# EAGLE schematic main (EAGLE 9.5.2)
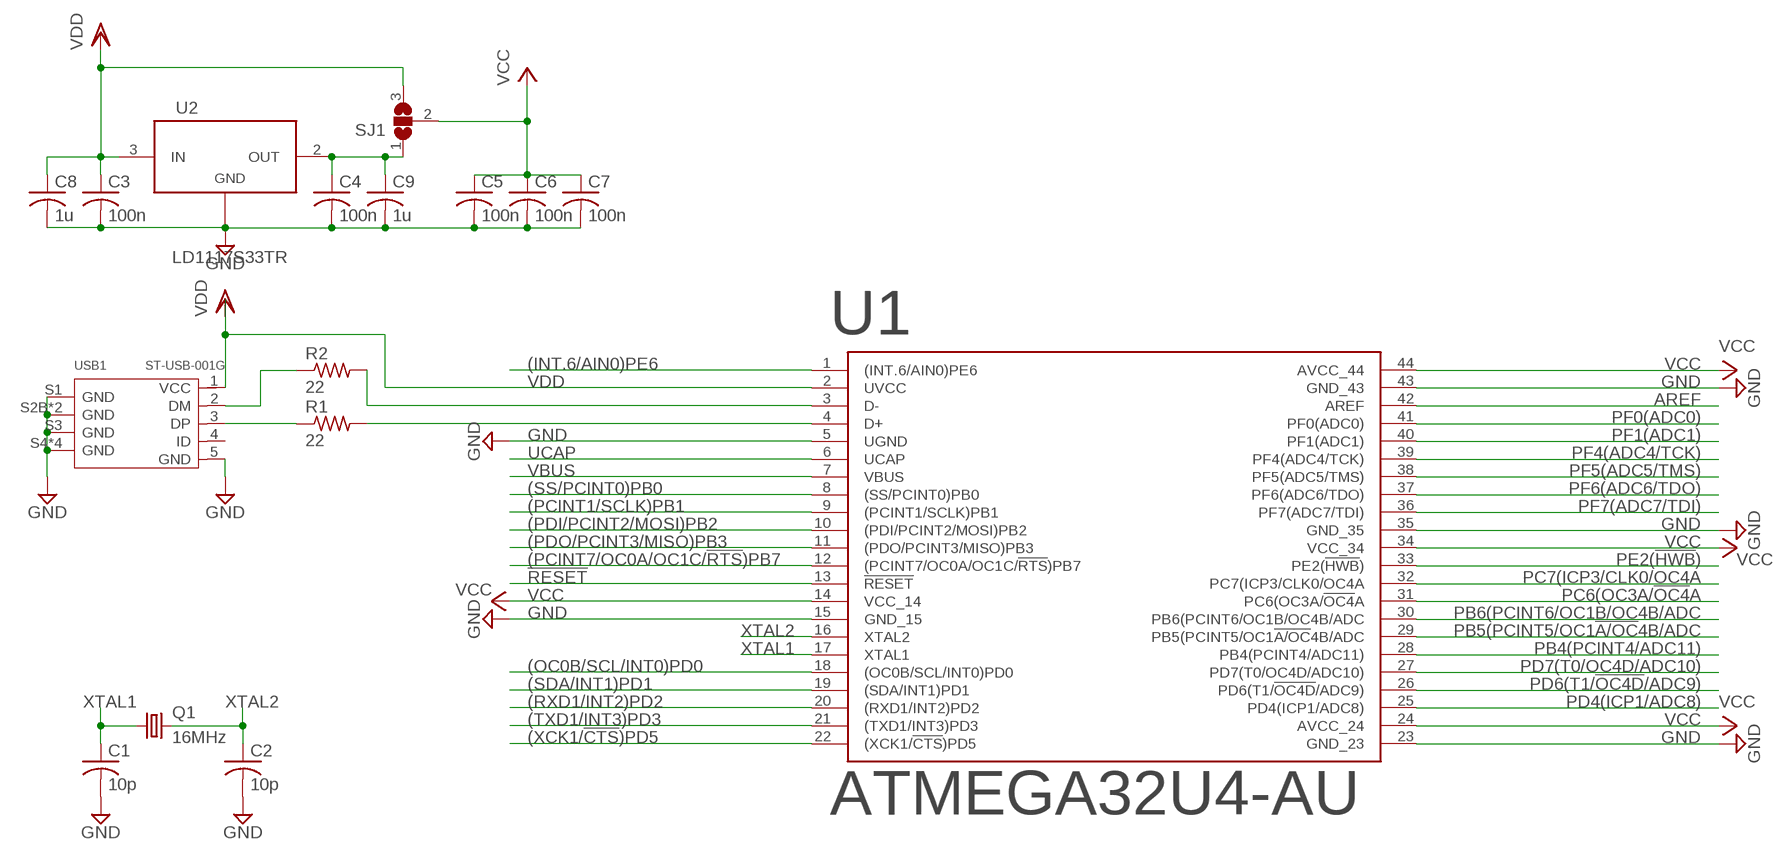
[diagram p0: schematic, sheet 1]

## Parts
C1  10p  C-USC0603  [C0603]
C2  10p  C-USC0603  [C0603]
C3  100n  C-USC0603  [C0603]
C4  100n  C-USC0603  [C0603]
C5  100n  C-USC0603  [C0603]
C6  100n  C-USC0603  [C0603]
C7  100n  C-USC0603  [C0603]
C8  1u  C-USC0805  [C0805]
C9  1u  C-USC0805  [C0805]
Q1  16MHz  CRYSTALHC49U-V  [HC49U-V]
R1  22  R-US_R0603  [R0603]
R2  22  R-US_R0603  [R0603]
SJ1  SJ2W  [SJ_2]
U1  ATMEGA32U4-AU  [44-TQFP]
U2  LD1117S33TR  [SOT-223]
USB1  ST-USB-001G  MICRO-USB-SMD-B-WITHOUT-POST-W/P(ST-USB-001G)  [MICRO-USB5+4P-SMD-0.65-B]

## Nets
!RESET: U1.13(!RESET)
(INT.6/AIN0)PE6: U1.1((INT.6/AIN0)PE6)
(OC0B/SCL/INT0)PD0: U1.18((OC0B/SCL/INT0)PD0)
(PCINT1/SCLK)PB1: U1.9((PCINT1/SCLK)PB1)
(PCINT7/OC0A/OC1C/!RTS!)PB7: U1.12((PCINT7/OC0A/OC1C/!RTS!)PB7)
(PDI/PCINT2/MOSI)PB2: U1.10((PDI/PCINT2/MOSI)PB2)
(PDO/PCINT3/MISO)PB3: U1.11((PDO/PCINT3/MISO)PB3)
(RXD1/INT2)PD2: U1.20((RXD1/INT2)PD2)
(SDA/INT1)PD1: U1.19((SDA/INT1)PD1)
(SS/PCINT0)PB0: U1.8((SS/PCINT0)PB0)
(TXD1/INT3)PD3: U1.21((TXD1/INT3)PD3)
(XCK1/!CTS!)PD5: U1.22((XCK1/!CTS!)PD5)
AREF: U1.42(AREF)
D+: R1.2 U1.4(D+)
D-: R2.2 U1.3(D-)
DM: R2.1 USB1.2(DM)
DP: R1.1 USB1.3(DP)
GND: C1.2 C2.2 C3.2 C4.2 C5.2 C6.2 C7.2 C8.2 C9.2 U1.5(UGND) U1.15(GND_15) U1.23(GND_23) U1.35(GND_35) U1.43(GND_43) U2.1(ADJ/GND) USB1.5(GND) USB1.S1(GND) USB1.S2B(GND) USB1.S2T(GND) USB1.S3(GND) USB1.S4(GND) USB1.S5B(GND) USB1.S5T(GND) USB1.S6(GND)
N$1: C4.1 C9.1 SJ1.1 U2.2(OUT) U2.4
PB4(PCINT4/ADC11): U1.28(PB4(PCINT4/ADC11))
PB5(PCINT5/OC1!A/OC!4B/ADC: U1.29(PB5(PCINT5/OC1!A/OC!4B/ADC)
PB6(PCINT6/OC1B/OC4B/ADC: U1.30(PB6(PCINT6/OC1B/OC4B/ADC)
PC6(OC3A/!OC4!A: U1.31(PC6(OC3A/!OC4!A)
PC7(ICP3/CLK0/OC4A: U1.32(PC7(ICP3/CLK0/OC4A)
PD4(ICP1/ADC8): U1.25(PD4(ICP1/ADC8))
PD6(T1/!OC4D!/ADC9): U1.26(PD6(T1/!OC4D!/ADC9))
PD7(T0/OC4D/ADC10): U1.27(PD7(T0/OC4D/ADC10))
PE2(!HWB!): U1.33(PE2(!HWB!))
PF0(ADC0): U1.41(PF0(ADC0))
PF1(ADC1): U1.40(PF1(ADC1))
PF4(ADC4/TCK): U1.39(PF4(ADC4/TCK))
PF5(ADC5/TMS): U1.38(PF5(ADC5/TMS))
PF6(ADC6/TDO): U1.37(PF6(ADC6/TDO))
PF7(ADC7/TDI): U1.36(PF7(ADC7/TDI))
UCAP: U1.6(UCAP)
VBUS: U1.7(VBUS)
VCC: C5.1 C6.1 C7.1 SJ1.2 U1.14(VCC_14) U1.24(AVCC_24) U1.34(VCC_34) U1.44(AVCC_44)
VDD: C3.1 C8.1 SJ1.3 U1.2(UVCC) U2.3(IN) USB1.1(VCC)
XTAL1: C1.1 Q1.1 U1.17(XTAL1)
XTAL2: C2.1 Q1.2 U1.16(XTAL2)
Unconnected: USB1.4(ID)

## Library data of the parts
C1-C9 = rcl:C-US: CAPACITOR, American symbol; SPICEPREFIX: C
Q1 = crystal:CRYSTAL: CRYSTAL; OC_FARNELL: 1666969; OC_NEWARK: unknown
R1 R2 = rcl:R-US_: RESISTOR, American symbol; SPICEPREFIX: R
SJ1 = jumper:SJ2W: SMD solder JUMPER
U1 = Microcontroller:ATMEGA32U4-AU: IC MCU 8BIT 32KB FLASH 44TQFP Manufacturer's datasheet <http://ww1.microchip.com/downloads/en/DeviceDoc/Atmel-7766-8-bit-AVR-ATmega16U4-32U4_Summary.pdf>; CREATED_BY: PCBLayout.com; DIGIKEY_PART_NUMBER: ATMEGA32U4-AU-ND; MANUFACTURER: Microchip Technology; MPN: ATMEGA32U4-AU; PACKAGE: 44-TQFP
U2 = IC:LD1117S33TR: IC REG LINEAR 3.3V 800MA SOT223 Manufacturer's datasheet <http://www.st.com/content/ccc/resource/technical/document/datasheet/99/3b/7d/91/91/51/4b/be/CD00000544.pdf/files/CD00000544.pdf/jcr:content/translations/en.CD00000544.pdf>; CREATED_BY: PCBLayout.com; DIGIKEY_PART_NUMBER: 497-1242-2-ND; MANUFACTURER: STMicroelectronics; MPN: LD1117S33TR; PACKAGE: SOT-223
USB1 = OPL_Connector:MICRO-USB-SMD-B-WITHOUT-POST-W/P(ST-USB-001G): Seeed SKU 320010000 - SMD Micro USB-B-W/P MPN: ST-USB-001G Important Notes: This part requires milling slots. Please make sure layer 46 Milling is included in the profile or outline layer when exporting Gerber files. Alternatively, you can use the built-in Seeed Fusion CAM file. Find it under Third-Party CAM files. This part has an overhanging portion. The edge of the PCB should be aligned with the line marked PCB Edge to be mounted correctly. Seeed Fusion PCBA OPL <https://www.seeedstudio.com/opl.html> Order PCB/PCBA Now <https://www.seeedstudio.com/fusion_pcb.html> www.seeedstudio.com; MPN: ST-USB-001G